# Altium project soft_starter.PrjPcb
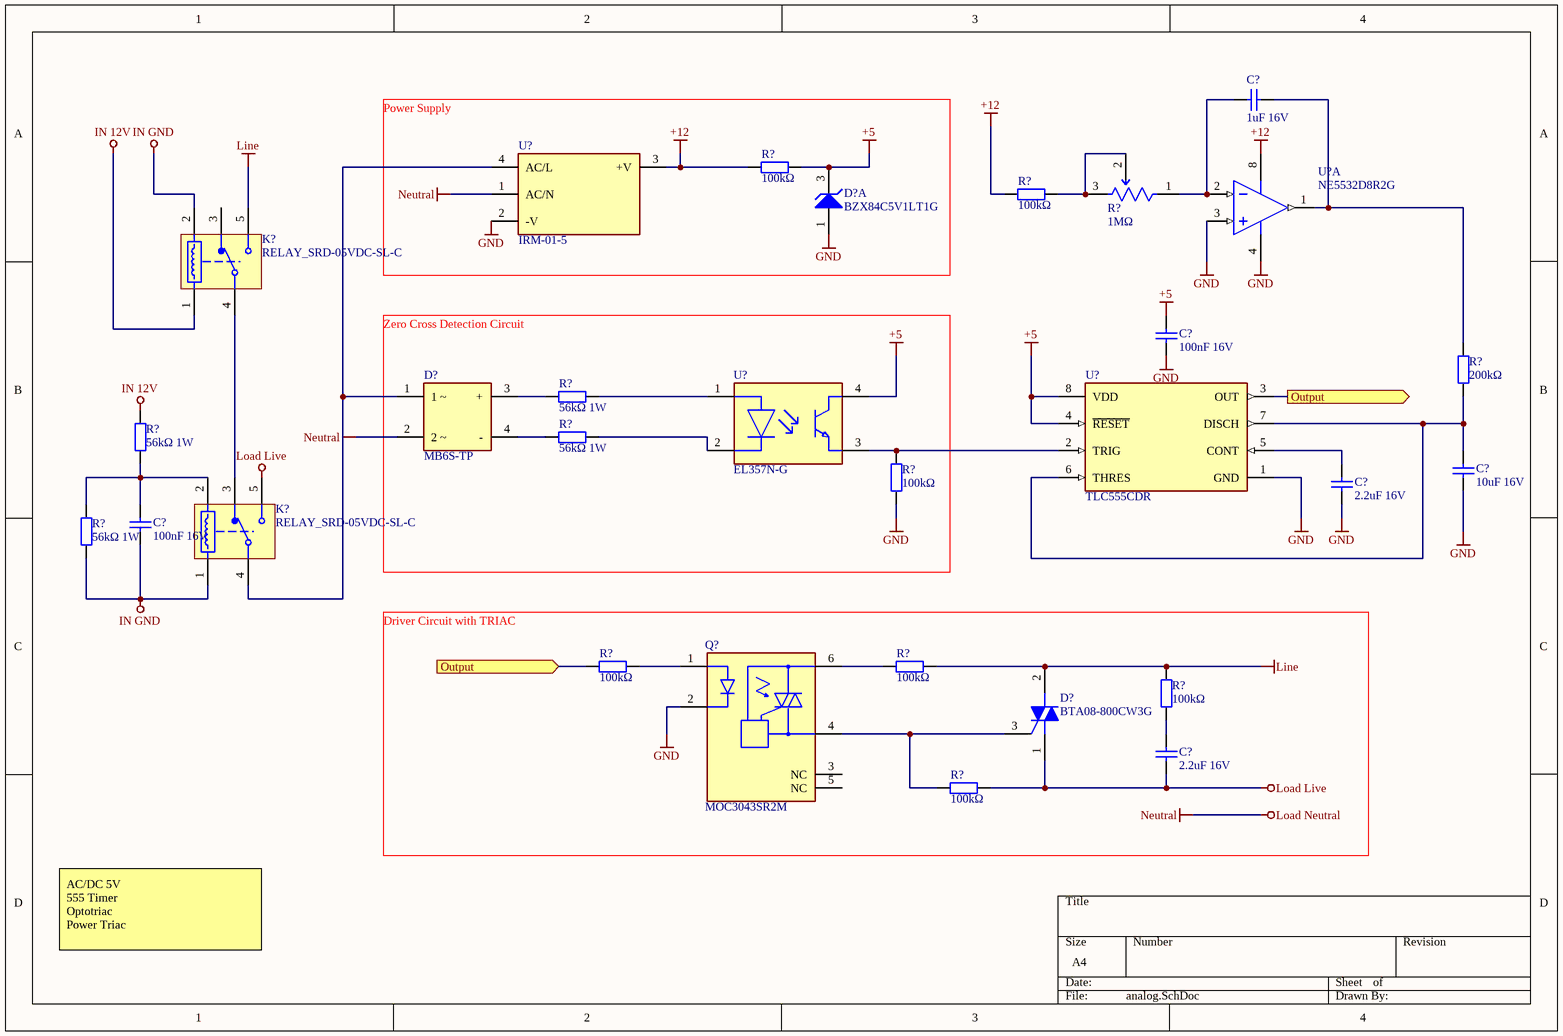
[diagram p0: analog.SchDoc]
3 sheets, 59 parts. Net scope: flat (ports and power ports of the same name join across sheets).
Sheets:
  analog.SchDoc
  mcu.SchDoc
  PCB_Project_MCU.SchDoc

## Sheet analog.SchDoc
size A4

### Parts
(Parts that share a designator on the sheet are numbered #1, #2 ... from top to bottom, then left to right.)
C?#1  1uF 16V  [CAP_0805]
C?#2  100nF 16V  [CAP_0805]
C?#3  10uF 16V  [CAP_0805]
C?#4  2.2uF 16V  [CAP_0805]
C?#5  100nF 16V  [CAP_0805]
C?#6  2.2uF 16V  [CAP_0805]
D?#1  BZX84C5V1LT1G  [ONSC-SOT-23-3-318-08_V]  (part A of 2)
D?#2  MB6S-TP  [FP-MBS-1-MFG]
D?#3  BTA08-800CW3G  [ONSC-TO-220-3-221A-07]
K?#1  RELAY_SRD-05VDC-SL-C  [SRD-05-VDC-SL-C]
K?#2  RELAY_SRD-05VDC-SL-C  [SRD-05-VDC-SL-C]
Q?#1  MOC3043SR2M  [FP-646BY-MFG]
R?#1  100kΩ  [RES_0805]
R?#2  100kΩ  [RES_0805]
R?#3  1MΩ  [FP-3386P-MFG]
R?#4  200kΩ  [RES_0805]
R?#5  56kΩ 1W  [RES_0805]
R?#6  56kΩ 1W  [RES_0805]
R?#7  56kΩ 1W  [RES_0805]
R?#8  100kΩ  [RES_0805]
R?#9  56kΩ 1W  [RES_0805]
R?#10  100kΩ  [RES_0805]
R?#11  100kΩ  [RES_0805]
R?#12  100kΩ  [RES_0805]
R?#13  100kΩ  [RES_0805]
U?#1  IRM-01-5  [FP-IRM-01-5-MFG]
U?#2  NE5532D8R2G  [ONSC-SOIC-8-751-07_V]  (part A of 2)
U?#3  TLC555CDR  [FP-D0008A-IPC_B]
U?#4  EL357N-G  [SOP-4_4mm]

### Ports
Output (in), Output (out)

### Nets
+5: C?#2.2 D?#1.3(K) R?#1.1 U?#3.4(~{RESET}) U?#3.8(VDD) U?#4.4(C)
+12: R?#1.2 R?#2.2 U?#1.3(+V) U?#2.8(V+)
GND: C?#2.1 C?#3.1 C?#4.1 D?#1.1(A) Q?#1.2(C) R?#8.1 U?#1.2(-V) U?#2.3(INA+) U?#2.4(V-) U?#3.1(GND)
IN 12V: K?#1.1 R?#7.2
IN GND: C?#5.1 K?#1.2 K?#2.1 R?#9.1
Line: D?#3.2(MT2) K?#1.5(NO) R?#11.1 R?#12.1
Load Live: C?#6.1 D?#3.1(MT1) K?#2.5(NO) R?#13.1
Load Neutral: D?#2.2(2_~) U?#1.1(AC/N)  [also labelled Neutral]
NetC?#1_1: C?#1.1 R?#3.1(CCW) U?#2.2(INA-)
NetC?#1_2: C?#1.2 R?#4.2 U?#2.1(OUTA)
NetC?#3_2: C?#3.2 R?#4.1 U?#3.6(THRES) U?#3.7(DISCH)
NetC?#4_2: C?#4.2 U?#3.5(CONT)
NetC?#5_2: C?#5.2 K?#2.2 R?#7.1 R?#9.2
NetC?#6_2: C?#6.2 R?#12.2
NetD?#2_1: D?#2.1(1_~) K?#2.4(COM) U?#1.4(AC/L)
NetD?#2_3: D?#2.3(+) R?#5.1
NetD?#2_4: D?#2.4(-) R?#6.1
NetD?#3_3: D?#3.3(G) Q?#1.4(1_MAIN_TERM.) R?#13.2
NetK?#1_4: K?#1.4(COM) K?#2.3(NC)
NetQ?#1_1: Q?#1.1(A) R?#10.1
NetQ?#1_6: Q?#1.6(2_MAIN_TERM.) R?#11.2
NetR?#2_1: R?#2.1 R?#3.2(WIPER) R?#3.3(CW)
NetR?#5_2: R?#5.2 U?#4.1(A)
NetR?#6_2: R?#6.2 U?#4.2(C)
NetR?#8_2: R?#8.2 U?#3.2(TRIG) U?#4.3(E)
NetR?#10_2: R?#10.2 U?#3.3(OUT) ; port Output

Not connected (* = marked no-connect by the designer): K?#1 3(NC); Q?#1 3(NC) 5(NC)

### Notes on the sheet
- Power Supply
- Zero Cross Detection Circuit
- Driver Circuit with TRIAC
- AC/DC 5V
  555 Timer
  Optotriac
  Power Triac

### Library data of the parts
C?#1-C?#6 = CAP_2.2uF_0805: Cap Ceramic 2.2uF 16V X7R 10% Pad SMD 0805 Soft Termination 125C Automotive T/R; Manufacturer: Murata; Manufacturer Part Number: GCJ21BR71C225KA13L; Supplier 1: Mouser; RoHS: Yes; Category: Ceramic Capacitors; Stock 1: 34901; Pricing 1: 1=0.49000, 10=0.34200, 50=0.34200, 100=0.20500, 500=0.15400, 1000=0.13000, 3000=0.12200, 6000=0.11600, 10000=0.11600 (USD); Mount: Surface Mount; Case/Package: 0805; Case Code (Metric): 2012; Case Code (Imperial): 0805; Min Operating Temperature: -55°C; Max Operating Temperature: 125°C; Capacitance: 2.2uF; Tolerance: 10%; Packaging: Tape and Reel; Voltage Rating: 16V; Dielectric: X7R; Voltage Rating (DC): 16V; Package Quantity: 1; Termination: SMD/SMT; Series: GCJ; Construction: Flat; Features: Soft Termination; Length: 2mm; Width: 0.049inch; Height: 1.25mm; Thickness: 0.057inch; Depth: 1.25mm; Ratings: AEC-Q200; Radiation Hardening: No; RoHS Compliant: Yes; Lead Free: Lead Free; ComponentLink1URL: https://datasheet.ciiva.com/172/product-172726.pdf?src-supplier=Digi-Key; ComponentLink1Description: https://datasheet.ciiva.com/172/product-172726.pdf?src-supplier=Digi-Key; ComponentLink2URL: https://datasheet.ciiva.com/172/s0717e-172727.pdf?src-supplier=Digi-Key; ComponentLink2Description: https://datasheet.ciiva.com/172/s0717e-172727.pdf?src-supplier=Digi-Key; ComponentLink3URL: https://datasheet.ciiva.com/172/s0717e-172728.pdf?src-supplier=Digi-Key; ComponentLink3Description: https://datasheet.ciiva.com/172/s0717e-172728.pdf?src-supplier=Digi-Key; Supplier Part Number 1: 81-GCJ21BR71C225KA3L
D?#1 = CMP-1060-00946-1: Zener Voltage Regulator, 225 mW, 3-Pin SOT-23, Pb-Free, Tape and Reel; Manufacturer: On Semiconductor; Mounting Technology: Surface Mount; ComponentLink1URL: http://www.onsemi.com/; PartNumber: BZX84C5V1LT1G; DatasheetVersion: Rev. 17; PackageDescription: 3-Pin Small Outline Transistor, Body 2.92 x 1.3 mm, Pitch 0.95 mm; ComponentLink2Description: Datasheet; PackageVersion: Rev. AP, 11/2009; PackageReference: SOT-23-3-318-08; ComponentLink3Description: Package Specification; RoHS: Pb-Free; ComponentLink3URL: http://www.onsemi.cn/pub_link/Collateral/318-08.PDF; ComponentLink2URL: http://www.onsemi.com/pub_link/Collateral/BZX84C2V4LT1-D.PDF; Packing: Tape and Reel; ComponentLink1Description: Manufacturer URL
D?#2 = CMP-56207-000002-1: BRIDGE RECT 1P 600V 500MA MBS-1; Manufacturer: MCC; Value: 13pF; Max Surge Forward Current: 35A; Standoff Height: 0.05mm; Max Junction Temp: +150°C; Forward Current: 0.5A; Peak Reverse Current: 5uA; Temperature: -55°C to +150°C; Temperature Range High: +150°C; Package: MBS-1; Temperature Range Low: -55°C; Octopart: https://octopart.com/mb6s-tp-mcc-733391; Max Repetitive Reverse Voltage: 600V; Mouser Description: Bridge Rectifiers .5A 600V; ComponentLink2URL: https://www.mccsemi.com/pdf/Products/MB05S-MB10S(MBS-1)-H.pdf; Reverse Voltage: 600V; ComponentLink2Description: Datasheet; Height: 2.9mm; Manufacturer Part Number: MB6S-TP; Lead Free: Yes; RoHS: TRUE; Category: Diode; Device Class L2: Diodes; Digikey Description: BRIDGE RECT 1P 600V 500MA MBS-1; Device Class L1: Discrete Semiconductors; Automotive: No; Device Class L3: Rectifier Diodes; Capacitance: 13pF
D?#3 = CMP-1070-00054-1: Triacs, Silicon Bidirectional Thyristor, 3-Pin TO-220, Pb-Free, Tube; Manufacturer: On Semiconductor; ITSM Max (A): 90; IT(RMS) Max (A): 8; IGT Max (mA): 35; ComponentLink2Description: Datasheet; PackageVersion: Rev. O, 07/2008; DatasheetVersion: Rev. 0; ComponentLink1Description: Manufacturer URL; Packing: Tube; PackageDescription: 3-Pin Flange Mount, Vertical Straight Lead, Body 9.97 x 4.445 mm, Pitch 2.54 mm; Mounting Technology: Through Hole; PackageReference: TO-220-3-221A-07; ComponentLink3Description: Package Specification; RoHS: Pb-Free; PartNumber: BTA08-800CW3G; ComponentLink1URL: http://www.onsemi.com/; ComponentLink3URL: http://www.onsemi.com/pub_link/Collateral/221A-07.PDF; ComponentLink2URL: http://www.onsemi.com/pub_link/Collateral/BTA08-800CW3-D.PDF
K?#1 K?#2 = RELAY_SRD-05VDC-SL-C: 5VDC SPDT Relay; Switching power: 240W; Max. AC current: 3A; Max. DC current: 7A; ca: 7A
Q?#1 = CMP-07144-000011-2: OPTOISOLATOR 4.17KV TRIAC 6SMD; Forward Voltage: 1.5V; Approvals: UL; Number of Circuits: 1; Output Voltage: 400V; Nominal Input Voltage: 1.25V; Hold Current: 400uA; Forward Current: 60mA; Max Power Dissipation: 250mW; Reverse Breakdown Voltage: 6V; Isolation Voltage: 5.25kV; Radiation Hardening: No; Number of Pins: 6; Max Input Voltage: 1.5V; Case/Package: SMD/SMT; Mount: Surface Mount; REACH SVHC: No SVHC; Number of Channels: 1; Weight: 0.81g; Contact Plating: Tin; Min Operating Temperature: -40°C; Packaging: Tape and Reel; Max Input Current: 60mA; Lead Free: Lead Free; Power Dissipation: 250mW; Input Current: 60mA; Max Operating Temperature: 85°C; Package Quantity: 1; Number of Elements: 1
R?#1 R?#2 R?#4-R?#13 = RES_100kohm_0805: Res Thick Film 0805 100K Ohm 1% 0.125W(1/8W) ±100ppm/°C Molded SMD Punched Carrier T/R; Manufacturer: Panasonic; Manufacturer Part Number: ERJ-6ENF1003V; Resistance: 100kR; Max Power Dissipation: 125mW; Voltage Rating (DC): 150V; Supplier 1: Mouser; RoHS: Yes; Category: Chip SMD Resistors; Stock 1: 3449; Pricing 1: 1=0.11000, 10=0.08300, 50=0.08300, 100=0.03200, 1000=0.01400, 2500=0.01300, 5000=0.01000, 10000=0.01000 (USD); Mount: Surface Mount; Case/Package: 0805; Number of Pins: 2; Case Code (Metric): 2012; Case Code (Imperial): 0805; Contact Plating: Tin; Min Operating Temperature: -55°C; Max Operating Temperature: 155°C; Tolerance: 1%; Packaging: Tape and Reel; Number of Terminations: 2; Temperature Coefficient: 100ppm/°C; Resistor Type: Thick Film; Features: Automotive AEC-Q200; Power Rating: 125mW; Package Quantity: 1; Voltage Rating: 150V; Termination: SMD/SMT; Length: 2mm; Width: 0.049inch; Height: 0.6mm; Depth: 1.25mm; Radiation Hardening: No; Lead Free: Lead Free; Military Standard: Not; REACH SVHC: No SVHC; ComponentLink1URL: https://datasheet.ciiva.com/11821/0900766b80f80784-11821507.pdf?src-supplier=RSComponents; ComponentLink1Description: https://datasheet.ciiva.com/11821/0900766b80f80784-11821507.pdf?src-supplier=RSComponents; ComponentLink2URL: https://datasheet.ciiva.com/22723/426256-22723909.pdf?src-supplier=Element14; ComponentLink2Description: https://datasheet.ciiva.com/22723/426256-22723909.pdf?src-supplier=Element14; ComponentLink3URL: https://datasheet.ciiva.com/46419/1678782-46419877.pdf?src-supplier=Element14; ComponentLink3Description: https://datasheet.ciiva.com/46419/1678782-46419877.pdf?src-supplier=Element14; ComponentLink4URL: https://datasheet.ciiva.com/27055/1988989-27055734.pdf?src-supplier=Jameco; ComponentLink4Description: https://datasheet.ciiva.com/27055/1988989-27055734.pdf?src-supplier=Jameco; ComponentLink5URL: https://datasheet.ciiva.com/16449/aoa0000ce2-16449480.pdf?src-supplier=Future+Electronics; ComponentLink5Description: https://datasheet.ciiva.com/16449/aoa0000ce2-16449480.pdf?src-supplier=Future+Electronics; ComponentLink6URL: https://datasheet.ciiva.com/17208/aoa0000ce2-17208153.pdf?src-supplier=Avnet+Europe; ComponentLink6Description: https://datasheet.ciiva.com/17208/aoa0000ce2-17208153.pdf?src-supplier=Avnet+Europe; ComponentLink7URL: https://datasheet.ciiva.com/22667/1678782-22667897.pdf?src-supplier=Element14; ComponentLink7Description: https://datasheet.ciiva.com/22667/1678782-22667897.pdf?src-supplier=Element14; ComponentLink8URL: https://datasheet.ciiva.com/24023/aoa0000ce2-24023497.pdf?src-supplier=Mouser; ComponentLink8Description: https://datasheet.ciiva.com/24023/aoa0000ce2-24023497.pdf?src-supplier=Mouser; ComponentLink9URL: https://datasheet.ciiva.com/7830/426256-7830746.pdf?src-supplier=Element14; ComponentLink9Description: https://datasheet.ciiva.com/7830/426256-7830746.pdf?src-supplier=Element14; ComponentLink10URL: https://datasheet.ciiva.com/30257/aoa0000ce2-30257690.pdf?src-supplier=Onlinecomponents.com; ComponentLink10Description: https://datasheet.ciiva.com/30257/aoa0000ce2-30257690.pdf?src-supplier=Onlinecomponents.com; ComponentLink11URL: https://datasheet.ciiva.com/7830/426256-7830988.pdf?src-supplier=Element14; ComponentLink11Description: https://datasheet.ciiva.com/7830/426256-7830988.pdf?src-supplier=Element14; ComponentLink12URL: https://datasheet.ciiva.com/16776/70260748-16776892.pdf?src-supplier=Allied+Electronics; ComponentLink12Description: https://datasheet.ciiva.com/16776/70260748-16776892.pdf?src-supplier=Allied+Electronics; ComponentLink13URL: https://datasheet.ciiva.com/16788/70260748-16788734.pdf?src-supplier=Allied+Electronics; ComponentLink13Description: https://datasheet.ciiva.com/16788/70260748-16788734.pdf?src-supplier=Allied+Electronics; ComponentLink14URL: https://datasheet.ciiva.com/48531/aoa0000ce2-48531486.pdf?src-supplier=Avnet; ComponentLink14Description: https://datasheet.ciiva.com/48531/aoa0000ce2-48531486.pdf?src-supplier=Avnet; Supplier Part Number 1: 667-ERJ-6ENF1003V
R?#3 = CMP-07234-000020-1: TRIMMER 1M OHM 0.5W PC PIN TOP; Manufacturer Part Number: 3386P-1-105TLF; Manufacturer: Bourns Inc.; Tolerance: 10%; Temperature Coefficient: 100ppm/°C; Standoff Height: 0.38mm; ComponentLink2URL: https://www.bourns.com/docs/Product-Datasheets/3386.pdf; Resistance: 1MΩ; Temperature Range High: +125°C; Category: Res; Temperature: -55°C to +125°C; Series: 3386; Temperature Range Low: -55°C; Device Class L3: Variable Resistors and Potentiometers; Value: 1MΩ; Power Rating: 0.5W; Digikey Description: TRIMMER 1M OHM 0.5W PC PIN TOP; Device Class L1: Passive Components; Package: 3386P; Automotive: No; Octopart: https://octopart.com/3386p-1-105tlf-bourns-2025467; Mouser Description: Trimmer Resistors - Through Hole 3/8 1Mohms 10% 0.5Watts Square; Device Class L2: Resistors; Composition: Cermet; ComponentLink2Description: Datasheet; Height: 5.08mm; RoHS: TRUE; Lead Free: Yes
U?#1 = CMP-28435-000004-1: AC/DC CONVERTER 5V 1W; RoHS Compliant: Yes; Lead Free: Lead Free
U?#2 = CMP-1310-00266-1: Internally Compensated Dual Low Noise Operational Amplifier, 6 to 40 V, 0 to 70 degC, 8-Pin SOIC, Pb-Free, Tape and Reel; Manufacturer: On Semiconductor; VCC Min (V): 6; SR Typ (V/uS): 9; GBW Typ (MHz): 10; VCC Max (V): 40; ComponentLink3URL: http://www.onsemi.com/pub_link/Collateral/751-07.PDF; Packing: Tape and Reel; ComponentLink2URL: http://www.onsemi.cn/pub_link/Collateral/NE5532-D.PDF; RoHS: TRUE; PackageReference: SOIC-8-751-07; ComponentLink1Description: Manufacturer URL; Mounting Technology: Surface Mount; PackageVersion: Rev. AK, 02/2011; PackageDescription: 8-Pin Small Outline Integrated Circuit, Body 4.9 x 3.9 mm, Pitch 1.27 mm; PartNumber: NE5532D8R2G; ComponentLink2Description: Datasheet; DatasheetVersion: Rev. 2; ComponentLink3Description: Package Specification; ComponentLink1URL: http://www.onsemi.com/
U?#3 = CMP-04857-000001-1: IC OSC SGL TIMER 2.1MHZ 8-SOIC; Min Supply Voltage: 2V; Number of Channels: 1; Max Power Dissipation: 725mW; Max Supply Voltage: 15V; Low Level Output Current: 100mA; Current Rating: 250A; Quiescent Current: 250uA; Operating Supply Current: 360uA; High Level Output Current: -10mA; Width: 3.91mm; Case/Package: SOIC; Weight: 0.002561oz; Frequency: 2.1MHz; Height: 1.58mm; Package Quantity: 2500; REACH SVHC: No SVHC; Number of Timers/Counters: 1; Lead Free: Lead Free; Number of Pins: 8; Max Operating Temperature: 125°C; Min Operating Temperature: -40°C; Length: 4.9mm; Radiation Hardening: No; Packaging: Tape and Reel; Termination: SMD/SMT; Mount: Surface Mount; Power Dissipation: 725mW
U?#4 = OPTOCOUPLER_EL357N-G: 4 PIN SOP PHOTOTRANSISTOR PHOTOCOUPLER / CTR: 50~600% at IF =5mA, VCE =5V / 4 Pin SOP with a 2.0 mm profile; ComponentLink1Description: Datasheet; ComponentLink1URL: https://www.mouser.com/datasheet/2/143/201407061738295695-365680.pdf

## Sheet mcu.SchDoc
size A4
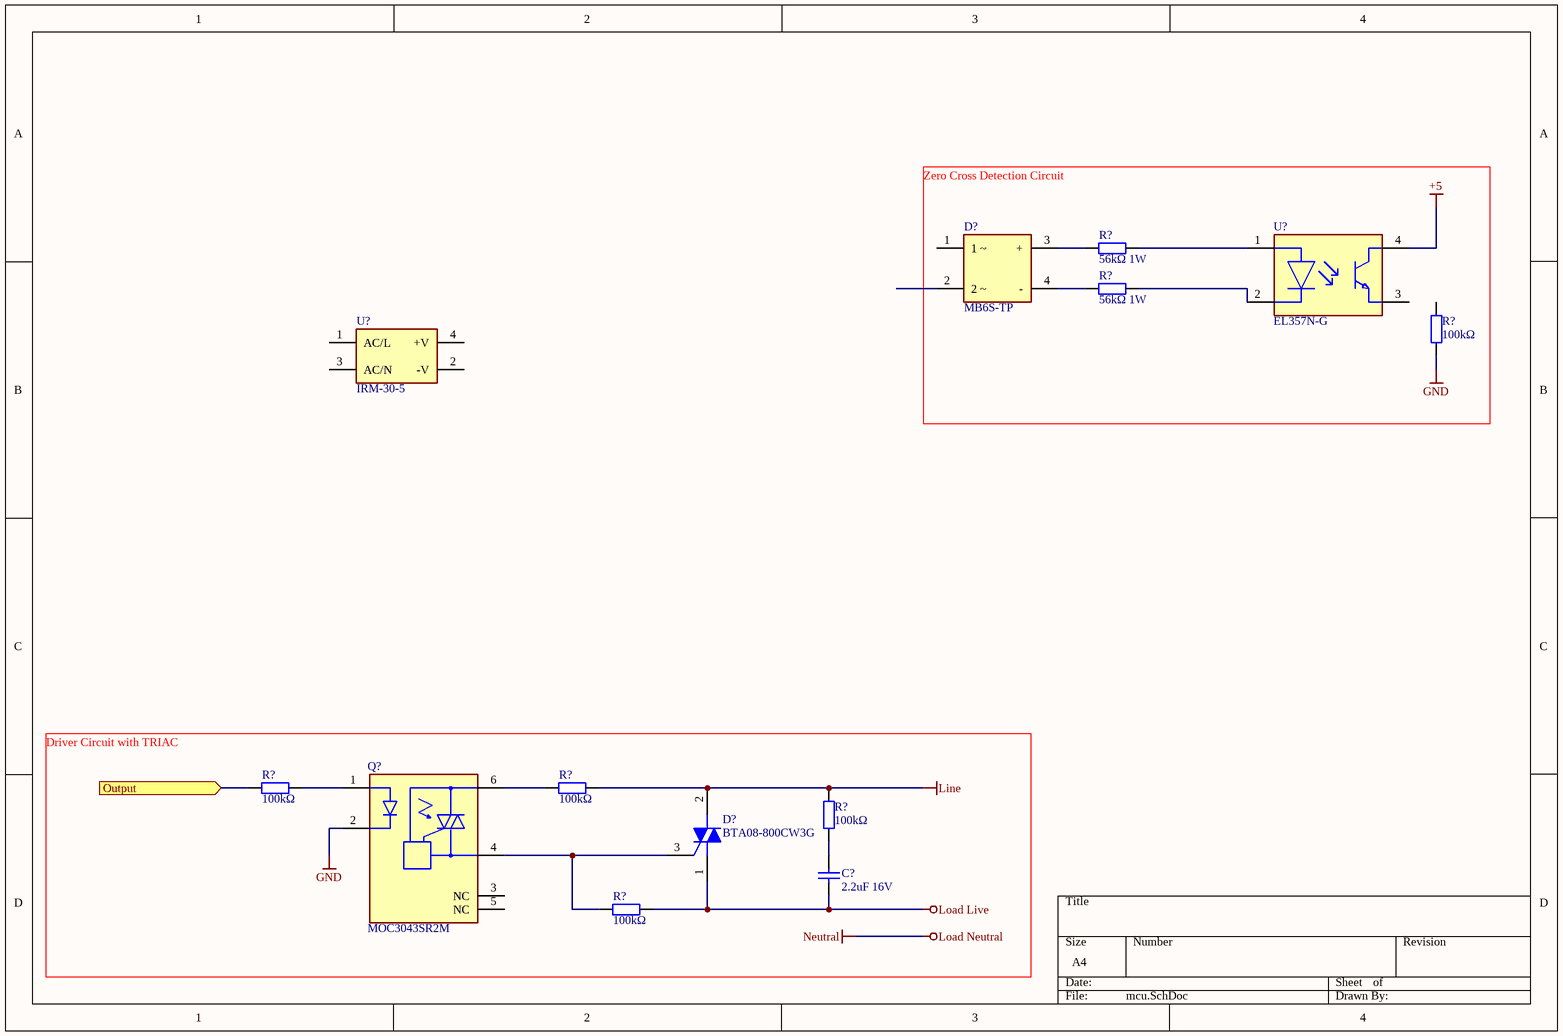
[diagram p1: mcu.SchDoc]

### Parts
(Parts that share a designator on the sheet are numbered #1, #2 ... from top to bottom, then left to right.)
C?#7  2.2uF 16V  [CAP_0805]
D?#4  MB6S-TP  [FP-MBS-1-MFG]
D?#5  BTA08-800CW3G  [ONSC-TO-220-3-221A-07]
Q?#2  MOC3043SR2M  [FP-646BY-MFG]
R?#14  56kΩ 1W  [RES_0805]
R?#15  56kΩ 1W  [RES_0805]
R?#16  100kΩ  [RES_0805]
R?#17  100kΩ  [RES_0805]
R?#18  100kΩ  [RES_0805]
R?#19  100kΩ  [RES_0805]
R?#20  100kΩ  [RES_0805]
U?#5  EL357N-G  [SOP-4_4mm]
U?#6  IRM-30-5  [FP-IRM-30-5-MFG]

### Ports
Output (in)

### Nets
+5: U?#5.4(C)
GND: Q?#2.2(C) R?#16.1
Line: D?#5.2(MT2) R?#18.1 R?#19.1
Load Live: C?#7.1 D?#5.1(MT1) R?#20.1
NetC?#7_2: C?#7.2 R?#19.2
NetD?#4_3: D?#4.3(+) R?#14.1
NetD?#4_4: D?#4.4(-) R?#15.1
NetD?#5_3: D?#5.3(G) Q?#2.4(1_MAIN_TERM.) R?#20.2
NetQ?#2_1: Q?#2.1(A) R?#17.1
NetQ?#2_6: Q?#2.6(2_MAIN_TERM.) R?#18.2
NetR?#10_2: R?#17.2 ; port Output
NetR?#14_2: R?#14.2 U?#5.1(A)
NetR?#15_2: R?#15.2 U?#5.2(C)

Not connected (* = marked no-connect by the designer): D?#4 1(1_~) 2(2_~); Q?#2 3(NC) 5(NC); R?#16 2; U?#5 3(E); U?#6 1(AC/L) 2(-V) 3(AC/N) 4(+V)

### Notes on the sheet
- Zero Cross Detection Circuit
- Driver Circuit with TRIAC

### Library data of the parts
C?#7 = CAP_2.2uF_0805: as C?#1 on sheet analog; Supplier 1: Mouser; RoHS: Yes; Category: Ceramic Capacitors; Stock 1: 34901; Pricing 1: 1=0.49000, 10=0.34200, 50=0.34200, 100=0.20500, 500=0.15400, 1000=0.13000, 3000=0.12200, 6000=0.11600, 10000=0.11600 (USD); Mount: Surface Mount; Case/Package: 0805; Case Code (Metric): 2012; Case Code (Imperial): 0805; Min Operating Temperature: -55°C; Max Operating Temperature: 125°C; Capacitance: 2.2uF; Tolerance: 10%; Packaging: Tape and Reel; Voltage Rating: 16V; Dielectric: X7R; Voltage Rating (DC): 16V; Package Quantity: 1; Termination: SMD/SMT; Series: GCJ; Construction: Flat; Features: Soft Termination; Length: 2mm; Width: 0.049inch; Height: 1.25mm; Thickness: 0.057inch; Depth: 1.25mm; Ratings: AEC-Q200; Radiation Hardening: No; RoHS Compliant: Yes; Lead Free: Lead Free; ComponentLink1URL: https://datasheet.ciiva.com/172/product-172726.pdf?src-supplier=Digi-Key; ComponentLink1Description: https://datasheet.ciiva.com/172/product-172726.pdf?src-supplier=Digi-Key; ComponentLink2URL: https://datasheet.ciiva.com/172/s0717e-172727.pdf?src-supplier=Digi-Key; ComponentLink2Description: https://datasheet.ciiva.com/172/s0717e-172727.pdf?src-supplier=Digi-Key; ComponentLink3URL: https://datasheet.ciiva.com/172/s0717e-172728.pdf?src-supplier=Digi-Key; ComponentLink3Description: https://datasheet.ciiva.com/172/s0717e-172728.pdf?src-supplier=Digi-Key; Supplier Part Number 1: 81-GCJ21BR71C225KA3L
D?#4 = CMP-56207-000002-1: as D?#2 on sheet analog; Temperature: -55°C to +150°C; Temperature Range High: +150°C; Package: MBS-1; Temperature Range Low: -55°C; Octopart: https://octopart.com/mb6s-tp-mcc-733391; Max Repetitive Reverse Voltage: 600V; Mouser Description: Bridge Rectifiers .5A 600V; ComponentLink2URL: https://www.mccsemi.com/pdf/Products/MB05S-MB10S(MBS-1)-H.pdf; Reverse Voltage: 600V; ComponentLink2Description: Datasheet; Height: 2.9mm; Manufacturer Part Number: MB6S-TP; Lead Free: Yes; RoHS: TRUE; Category: Diode; Device Class L2: Diodes; Digikey Description: BRIDGE RECT 1P 600V 500MA MBS-1; Device Class L1: Discrete Semiconductors; Automotive: No; Device Class L3: Rectifier Diodes; Capacitance: 13pF
D?#5 = CMP-1070-00054-1: as D?#3 on sheet analog; ComponentLink2Description: Datasheet; PackageVersion: Rev. O, 07/2008; DatasheetVersion: Rev. 0; ComponentLink1Description: Manufacturer URL; Packing: Tube; PackageDescription: 3-Pin Flange Mount, Vertical Straight Lead, Body 9.97 x 4.445 mm, Pitch 2.54 mm; Mounting Technology: Through Hole; PackageReference: TO-220-3-221A-07; ComponentLink3Description: Package Specification; RoHS: Pb-Free; PartNumber: BTA08-800CW3G; ComponentLink1URL: http://www.onsemi.com/; ComponentLink3URL: http://www.onsemi.com/pub_link/Collateral/221A-07.PDF; ComponentLink2URL: http://www.onsemi.com/pub_link/Collateral/BTA08-800CW3-D.PDF
Q?#2 = CMP-07144-000011-2: as Q?#1 on sheet analog; Radiation Hardening: No; Number of Pins: 6; Max Input Voltage: 1.5V; Case/Package: SMD/SMT; Mount: Surface Mount; REACH SVHC: No SVHC; Number of Channels: 1; Weight: 0.81g; Contact Plating: Tin; Min Operating Temperature: -40°C; Packaging: Tape and Reel; Max Input Current: 60mA; Lead Free: Lead Free; Power Dissipation: 250mW; Input Current: 60mA; Max Operating Temperature: 85°C; Package Quantity: 1; Number of Elements: 1
R?#14-R?#20 = RES_100kohm_0805: as R?#1 on sheet analog; Supplier 1: Mouser; RoHS: Yes; Category: Chip SMD Resistors; Stock 1: 3449; Pricing 1: 1=0.11000, 10=0.08300, 50=0.08300, 100=0.03200, 1000=0.01400, 2500=0.01300, 5000=0.01000, 10000=0.01000 (USD); Mount: Surface Mount; Case/Package: 0805; Number of Pins: 2; Case Code (Metric): 2012; Case Code (Imperial): 0805; Contact Plating: Tin; Min Operating Temperature: -55°C; Max Operating Temperature: 155°C; Tolerance: 1%; Packaging: Tape and Reel; Number of Terminations: 2; Temperature Coefficient: 100ppm/°C; Resistor Type: Thick Film; Features: Automotive AEC-Q200; Power Rating: 125mW; Package Quantity: 1; Voltage Rating: 150V; Termination: SMD/SMT; Length: 2mm; Width: 0.049inch; Height: 0.6mm; Depth: 1.25mm; Radiation Hardening: No; Lead Free: Lead Free; Military Standard: Not; REACH SVHC: No SVHC; ComponentLink1URL: https://datasheet.ciiva.com/11821/0900766b80f80784-11821507.pdf?src-supplier=RSComponents; ComponentLink1Description: https://datasheet.ciiva.com/11821/0900766b80f80784-11821507.pdf?src-supplier=RSComponents; ComponentLink2URL: https://datasheet.ciiva.com/22723/426256-22723909.pdf?src-supplier=Element14; ComponentLink2Description: https://datasheet.ciiva.com/22723/426256-22723909.pdf?src-supplier=Element14; ComponentLink3URL: https://datasheet.ciiva.com/46419/1678782-46419877.pdf?src-supplier=Element14; ComponentLink3Description: https://datasheet.ciiva.com/46419/1678782-46419877.pdf?src-supplier=Element14; ComponentLink4URL: https://datasheet.ciiva.com/27055/1988989-27055734.pdf?src-supplier=Jameco; ComponentLink4Description: https://datasheet.ciiva.com/27055/1988989-27055734.pdf?src-supplier=Jameco; ComponentLink5URL: https://datasheet.ciiva.com/16449/aoa0000ce2-16449480.pdf?src-supplier=Future+Electronics; ComponentLink5Description: https://datasheet.ciiva.com/16449/aoa0000ce2-16449480.pdf?src-supplier=Future+Electronics; ComponentLink6URL: https://datasheet.ciiva.com/17208/aoa0000ce2-17208153.pdf?src-supplier=Avnet+Europe; ComponentLink6Description: https://datasheet.ciiva.com/17208/aoa0000ce2-17208153.pdf?src-supplier=Avnet+Europe; ComponentLink7URL: https://datasheet.ciiva.com/22667/1678782-22667897.pdf?src-supplier=Element14; ComponentLink7Description: https://datasheet.ciiva.com/22667/1678782-22667897.pdf?src-supplier=Element14; ComponentLink8URL: https://datasheet.ciiva.com/24023/aoa0000ce2-24023497.pdf?src-supplier=Mouser; ComponentLink8Description: https://datasheet.ciiva.com/24023/aoa0000ce2-24023497.pdf?src-supplier=Mouser; ComponentLink9URL: https://datasheet.ciiva.com/7830/426256-7830746.pdf?src-supplier=Element14; ComponentLink9Description: https://datasheet.ciiva.com/7830/426256-7830746.pdf?src-supplier=Element14; ComponentLink10URL: https://datasheet.ciiva.com/30257/aoa0000ce2-30257690.pdf?src-supplier=Onlinecomponents.com; ComponentLink10Description: https://datasheet.ciiva.com/30257/aoa0000ce2-30257690.pdf?src-supplier=Onlinecomponents.com; ComponentLink11URL: https://datasheet.ciiva.com/7830/426256-7830988.pdf?src-supplier=Element14; ComponentLink11Description: https://datasheet.ciiva.com/7830/426256-7830988.pdf?src-supplier=Element14; ComponentLink12URL: https://datasheet.ciiva.com/16776/70260748-16776892.pdf?src-supplier=Allied+Electronics; ComponentLink12Description: https://datasheet.ciiva.com/16776/70260748-16776892.pdf?src-supplier=Allied+Electronics; ComponentLink13URL: https://datasheet.ciiva.com/16788/70260748-16788734.pdf?src-supplier=Allied+Electronics; ComponentLink13Description: https://datasheet.ciiva.com/16788/70260748-16788734.pdf?src-supplier=Allied+Electronics; ComponentLink14URL: https://datasheet.ciiva.com/48531/aoa0000ce2-48531486.pdf?src-supplier=Avnet; ComponentLink14Description: https://datasheet.ciiva.com/48531/aoa0000ce2-48531486.pdf?src-supplier=Avnet; Supplier Part Number 1: 667-ERJ-6ENF1003V
U?#5 = OPTOCOUPLER_EL357N-G: as U?#4 on sheet analog; ComponentLink1Description: Datasheet; ComponentLink1URL: https://www.mouser.com/datasheet/2/143/201407061738295695-365680.pdf
U?#6 = CMP-28435-000001-1: AC/DC CONVERTER 5V 30W; Manufacturer: Mean Well; Output Type: Fixed; Switching Topology: Buck; Max Supply Voltage: 264V; Number Of Outputs: 1; Description: Miniature AC-DC Module type Power Supply 5 Volts 6 Amps 30 W; Switching Frequency: 65kHz; Nominal Supply Current: 0.5-0.75A; Min Supply Voltage: 85V; Output Current: 6A; Temperature: -30°C to +70°C; Device Class L1: Integrated Circuits (ICs); Temperature Range Low: -30°C; Temperature Range High: +70°C; ComponentLink2Description: Datasheet; Lead Free: Yes; Device Class L2: Power Management ICs; ComponentLink2URL: https://www.meanwell-web.com/content/files/pdfs/productPdfs/MW/IRM-30/IRM-30-spec.pdf; Mouser Description: 30W Encapsulated Board Mount Module AC/DC Power Supply with 5VDC Output; Automotive: No; Device Class L3: Voltage Regulators - Switching; Octopart: https://octopart.com/irm-30-5-mean+well-50976023; Category: IC; Package: IRM-30-5; Output Voltage: 5V; RoHS: TRUE; Manufacturer Part Number: IRM-30-5; Height: 24mm; Digikey Description: AC/DC CONVERTER 5V 30W

## Sheet PCB_Project_MCU.SchDoc
size A4; SheetTotal: 6; ImagePath: 6
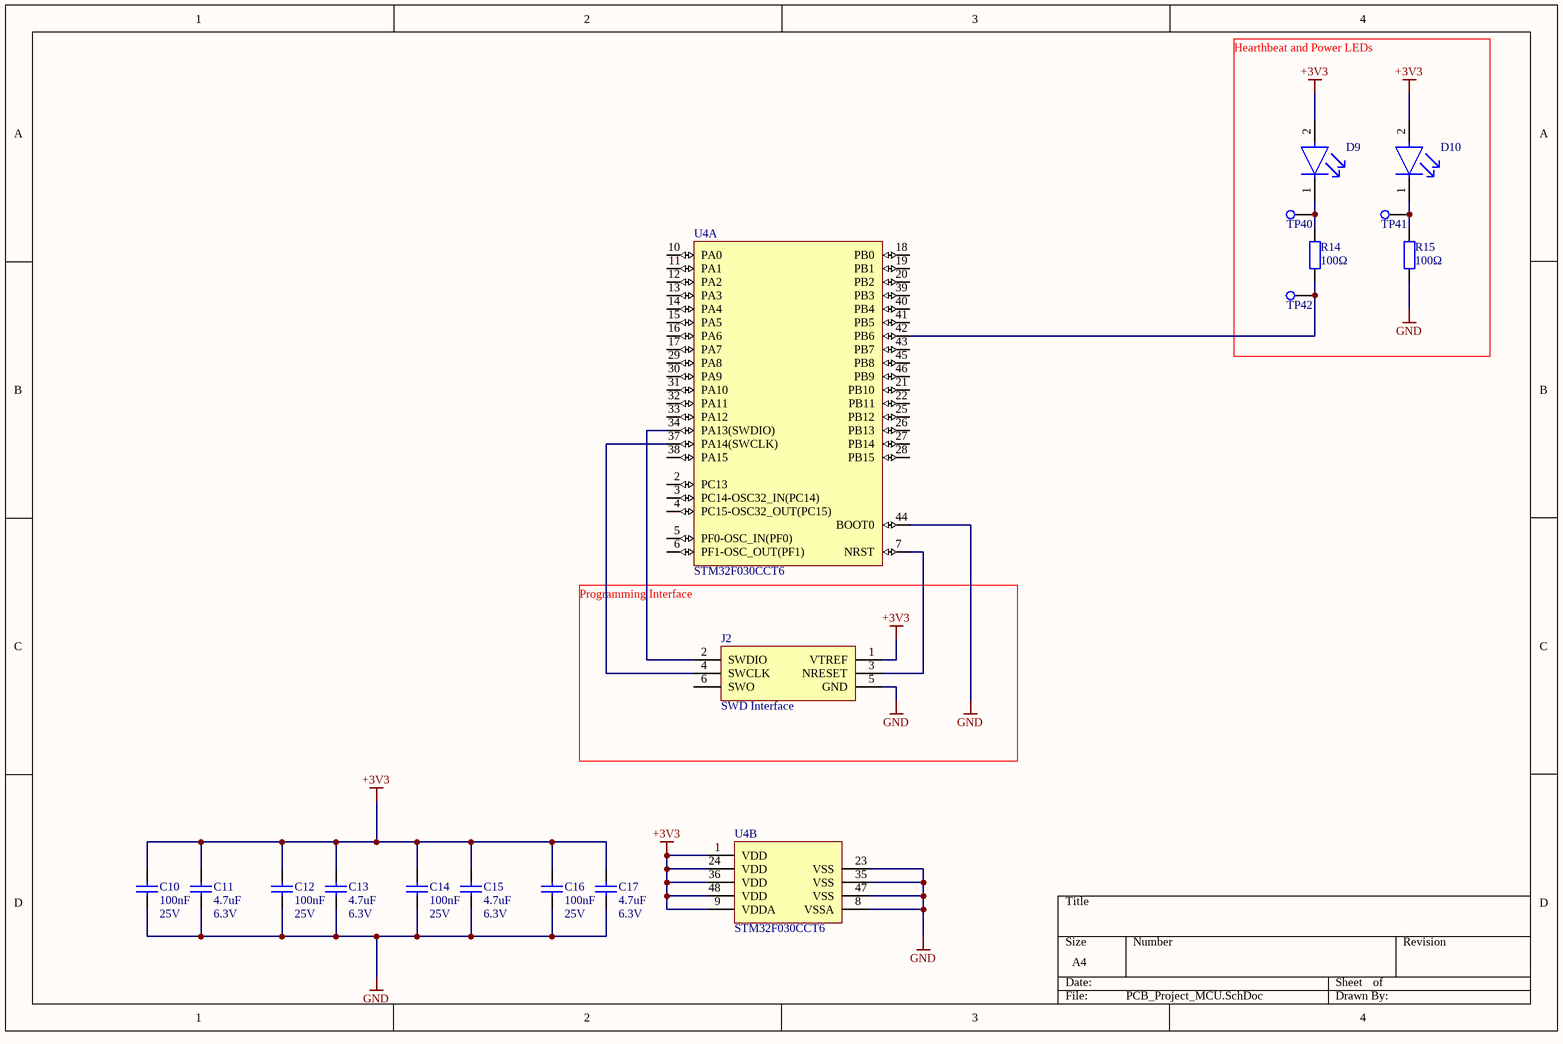
[diagram p2: PCB_Project_MCU.SchDoc]

### Parts
C10  Capacitance: 100nF  Voltage Rating: 25V  [CAPC2013X88X50ML20T25]  (hidden comment: Cap_100nF)
C11  Capacitance: 4.7uF  Voltage Rating: 6.3V  [CAPC2013X88X50ML20T25]  (hidden comment: Cap_4.7uF)
C12  Capacitance: 100nF  Voltage Rating: 25V  [CAPC2013X88X50ML20T25]  (hidden comment: Cap_100nF)
C13  Capacitance: 4.7uF  Voltage Rating: 6.3V  [CAPC2013X88X50ML20T25]  (hidden comment: Cap_4.7uF)
C14  Capacitance: 100nF  Voltage Rating: 25V  [CAPC2013X88X50ML20T25]  (hidden comment: Cap_100nF)
C15  Capacitance: 4.7uF  Voltage Rating: 6.3V  [CAPC2013X88X50ML20T25]  (hidden comment: Cap_4.7uF)
C16  Capacitance: 100nF  Voltage Rating: 25V  [CAPC2013X88X50ML20T25]  (hidden comment: Cap_100nF)
C17  Capacitance: 4.7uF  Voltage Rating: 6.3V  [CAPC2013X88X50ML20T25]  (hidden comment: Cap_4.7uF)
D9  LTST-C171GKT  [green_led]  (value not drawn)
D10  LTST-C171GKT  [green_led]  (value not drawn)
J2  SWD Interface  [J-Link_6-pin_Needle_Adapter]  (no BOM)
R14  Resistance: 100Ω  [RESC2013X50X30ML20T20]  (hidden comment: Res_120ohm)
R15  Resistance: 100Ω  [RESC2013X50X30ML20T20]  (hidden comment: Res_100ohm)
TP40  Testpoint  [TESTPOINT]  (value not drawn)  (no BOM)
TP41  Testpoint  [TESTPOINT]  (value not drawn)  (no BOM)
TP42  Testpoint  [TESTPOINT]  (value not drawn)  (no BOM)
U4  STM32F030CCT6  [STM-LQFP48_N]  (parts A,B of 2)

### Nets
+3V3: C10.2 C11.2 C12.2 C13.2 C14.2 C15.2 C16.2 C17.2 D9.2(A) D10.2(A) J2.1(VTREF) U4.1(VDD) U4.9(VDDA) U4.24(VDD) U4.36(VDD) U4.48(VDD)
GND: C10.1 C11.1 C12.1 C13.1 C14.1 C15.1 C16.1 C17.1 J2.5(GND) R15.1 U4.8(VSSA) U4.23(VSS) U4.35(VSS) U4.44(BOOT0) U4.47(VSS)
NetD9_1: D9.1(C) R14.2 TP40.TP
NetD10_1: D10.1(C) R15.2 TP41.TP
NetJ2_2: J2.2(SWDIO) U4.34(PA13(SWDIO))
NetJ2_3: J2.3(NRESET) U4.7(NRST)
NetJ2_4: J2.4(SWCLK) U4.37(PA14(SWCLK))
NetR14_1: R14.1 TP42.TP U4.42(PB6)

Not connected (* = marked no-connect by the designer): J2 6(SWO); U4 2(PC13) 3(PC14-OSC32_IN(PC14)) 4(PC15-OSC32_OUT(PC15)) 5(PF0-OSC_IN(PF0)) 6(PF1-OSC_OUT(PF1)) 10(PA0) 11(PA1) 12(PA2) 13(PA3) 14(PA4) 15(PA5) 16(PA6) 17(PA7) 18(PB0) 19(PB1) 20(PB2) 21(PB10) 22(PB11) 25(PB12) 26(PB13) 27(PB14) 28(PB15) 29(PA8) 30(PA9) 31(PA10) 32(PA11) 33(PA12) 38(PA15) 39(PB3) 40(PB4) 41(PB5) 43(PB7) 45(PB8) 46(PB9)

### Notes on the sheet
- Hearthbeat and Power LEDs
- (near J2) Programming Interface
- Gezeichnet:
- Artikelname:
- Biral AG
- CH 3110 Münsingen
- Format:
- Blatt:
- A4
- Artikelnummer:
- Zeichnungsnummer:
- Geprüft:
- Index:
- of

### Library data of the parts
C10 C12 C14 C16 = Cap_100nF: Capacitor; Manufacturer 1: KEMET; Manufacturer Part Number 1: C0805C104M3RACTU; Dielectric Material: Ceramic; Tolerance: 20%; Dielectric: X7R; Dissipation Factor: 5%; Supplier 1: Farnell; Stock 1: 12809; Pricing 1: 10=0.07910, 100=0.04240, 500=0.02510, 1000=0.02420, 2000=0.02100, 4000=0.01800, 20000=0.01260 (CHF); RoHS: Yes; Mount: Surface Mount; Case/Package: 0805; Case Code (Metric): 2012; Case Code (Imperial): 0805; Min Operating Temperature: -55°C; Max Operating Temperature: 125°C; Packaging: Tape and Reel; Package Quantity: 1; Voltage Rating (DC): 25V; Termination: SMD/SMT; Voltage: 25V; Length: 2mm; Height: 0.9mm; Width: 0.049inch; Thickness: 0.035inch; Depth: 1.25mm; Lead Pitch: 0.75mm; Radiation Hardening: No; REACH SVHC: No SVHC; ComponentLink1URL: http://uk.rs-online.com/webdocs/13da/0900766b813daa05.pdf?src-supplier=RSComponents; ComponentLink1Description: http://uk.rs-online.com/webdocs/13da/0900766b813daa05.pdf?src-supplier=RSComponents; ComponentLink2URL: http://www.mouser.com/ds/2/212/KEM_C1002_X7R_SMD-1102033.pdf?src-supplier=Mouser; ComponentLink2Description: http://www.mouser.com/ds/2/212/KEM_C1002_X7R_SMD-1102033.pdf?src-supplier=Mouser; ComponentLink3URL: http://www.farnell.com/datasheets/2746330.pdf?src-supplier=Farnell; ComponentLink3Description: http://www.farnell.com/datasheets/2746330.pdf?src-supplier=Farnell; ComponentLink4URL: https://www.alliedelec.com/m/d/6f3b5eb83d09db50ed28bdc730567b33.pdf?src-supplier=Allied+Electronics; ComponentLink4Description: https://www.alliedelec.com/m/d/6f3b5eb83d09db50ed28bdc730567b33.pdf?src-supplier=Allied+Electronics; ComponentLink5URL: http://uk.rs-online.com/webdocs/13da/0900766b813da9ff.pdf?src-supplier=RSComponents; ComponentLink5Description: http://uk.rs-online.com/webdocs/13da/0900766b813da9ff.pdf?src-supplier=RSComponents; ComponentLink6URL: https://www.alliedelec.com/m/d/e7aa2b5497e2375e4ffc0e8be19e16e2.pdf?src-supplier=Allied+Electronics; ComponentLink6Description: https://www.alliedelec.com/m/d/e7aa2b5497e2375e4ffc0e8be19e16e2.pdf?src-supplier=Allied+Electronics; ComponentLink7URL: http://components.arrow.com/part/dataview/0323_00178100?src-supplier=Arrow+Europe; ComponentLink7Description: http://components.arrow.com/part/dataview/0323_00178100?src-supplier=Arrow+Europe; ComponentLink8URL: http://www.jameco.com/Jameco/Products/ProdDS/1566487.pdf?src-supplier=Jameco; ComponentLink8Description: http://www.jameco.com/Jameco/Products/ProdDS/1566487.pdf?src-supplier=Jameco; ComponentLink9URL: https://api.kemet.com/component-edge/download/datasheet/C0805C104M3RACTU.pdf?src-supplier=Digi-Key; ComponentLink9Description: https://api.kemet.com/component-edge/download/datasheet/C0805C104M3RACTU.pdf?src-supplier=Digi-Key; ComponentLink10URL: http://www.farnell.com/datasheets/2746330.pdf?src-supplier=Newark; ComponentLink10Description: http://www.farnell.com/datasheets/2746330.pdf?src-supplier=Newark; ComponentLink11URL: http://capacitoredge.kemet.com/capedge2/DataSheet?pn=C0805C104M3RACTU&src-supplier=Avnet; ComponentLink11Description: http://capacitoredge.kemet.com/capedge2/DataSheet?pn=C0805C104M3RACTU&src-supplier=Avnet; ComponentLink12URL: http://components.arrow.com/part/dataview/2091097S3491315N7429?src-supplier=Arrow; ComponentLink12Description: http://components.arrow.com/part/dataview/2091097S3491315N7429?src-supplier=Arrow; Supplier Part Number 1: 2773209
C11 C13 C15 C17 = Cap_4.7uF: Capacitor; Manufacturer 1: KEMET; Manufacturer Part Number 1: C0805C475K9PACTU; Dielectric Material: Ceramic; Tolerance: 10%; Dielectric: X5R; Dissipation Factor: 5%; Supplier 1: Farnell; Stock 1: 17500; Pricing 1: 2500=0.02880, 12500=0.02710 (CHF); RoHS: Yes; Mount: Surface Mount; Case/Package: 0805; Number of Pins: 2; Case Code (Imperial): 0805; Case Code (Metric): 2012; Min Operating Temperature: -55°C; Max Operating Temperature: 85°C; Packaging: Tape and Reel; Voltage Rating (DC): 6.3V; Termination: SMD/SMT; Package Quantity: 1; Voltage: 6.3V; Length: 2mm; Height: 1.25mm; Width: 1.2mm; Thickness: 0.055inch; Depth: 1.25mm; Lead Pitch: 0.75mm; Radiation Hardening: No; Lead Free: Lead Free; REACH SVHC: No SVHC; ComponentLink1URL: https://datasheet.ciiva.com/7842/1847039-7842373.pdf?src-supplier=Element14; ComponentLink1Description: https://datasheet.ciiva.com/7842/1847039-7842373.pdf?src-supplier=Element14; ComponentLink2URL: https://datasheet.ciiva.com/7842/1847039-7842374.pdf?src-supplier=Element14; ComponentLink2Description: https://datasheet.ciiva.com/7842/1847039-7842374.pdf?src-supplier=Element14; ComponentLink3URL: https://datasheet.ciiva.com/28614/kem-c1006-x5r-smd-28614764.pdf?src-supplier=Element14; ComponentLink3Description: https://datasheet.ciiva.com/28614/kem-c1006-x5r-smd-28614764.pdf?src-supplier=Element14; ComponentLink4URL: https://datasheet.ciiva.com/28682/1789732-28682365.pdf?src-supplier=Element14; ComponentLink4Description: https://datasheet.ciiva.com/28682/1789732-28682365.pdf?src-supplier=Element14; Supplier Part Number 1: 2392260
D9 D10 = LTST-C171GKT: LED GREEN CLEAR CHIP SMD; Luminous Intensity: 12mcd; Lens Color: Colorless; Dominant Wavelength: 569nm; Number of LEDs: 1; Power Dissipation: 100mW; Viewing Angle: 130°; Reverse Voltage: 5V; Test Current: 10mA; Forward Voltage: 2.1V; Wavelength: 585nm; Lens Style: Diffused; Forward Current: 30mA; Height: 0.8mm; Mount: Surface Mount; Package Quantity: 1; Length: 2mm; Case Code (Metric): 2012; Number of Pins: 2; Number of Elements: 1; Packaging: Tape and Reel; Color: Green; Min Operating Temperature: -55°C; Case/Package: 0805; Power Rating: 100mW; Max Operating Temperature: 85°C; Radiation Hardening: No; Depth: 1.25mm; Lens Transparency: Clear; Width: 1.25mm; Lead Free: Lead Free; Case Code (Imperial): 0805; Illumination Color: Green
J2 = J-Link_6-pin_Needle_Adapter: J-Link 6-pin Needle Adapter
R14 = Res_120ohm: Resistor; Manufacturer 1: Panasonic; Manufacturer Part Number 1: ERJ-6ENF1200V; Tolerance: 1%; Temperature Coefficient: 100ppm/°C; Power Rating: 125mW; Voltage Rating: 150V; Supplier 1: Farnell; Stock 1: 19028; Pricing 1: 10=0.09940, 100=0.03710, 500=0.02940, 1000=0.01260, 2500=0.01050 (CHF); RoHS: Yes; Mount: Surface Mount; Case/Package: 0805; Number of Pins: 2; Case Code (Imperial): 0805; Case Code (Metric): 2012; Contact Plating: Tin; Min Operating Temperature: -55°C; Max Operating Temperature: 155°C; Packaging: Tape and Reel; Composition: Thick Film; Package Quantity: 1; Termination: SMD/SMT; Max Power Dissipation: 125mW; Voltage Rating (DC): 150V; Number of Terminations: 2; Military Standard: Not; Features: Automotive AEC-Q200; Length: 2mm; Height: 0.6mm; Width: 1.2mm; Depth: 1.25mm; Radiation Hardening: No; REACH SVHC: No SVHC; Lead Free: Lead Free; ComponentLink1URL: https://datasheet.ciiva.com/11821/0900766b80f80784-11821533.pdf?src-supplier=RSComponents; ComponentLink1Description: https://datasheet.ciiva.com/11821/0900766b80f80784-11821533.pdf?src-supplier=RSComponents; ComponentLink2URL: https://datasheet.ciiva.com/22673/1678782-22673701.pdf?src-supplier=Element14; ComponentLink2Description: https://datasheet.ciiva.com/22673/1678782-22673701.pdf?src-supplier=Element14; ComponentLink3URL: https://datasheet.ciiva.com/15158/getdatasheetpartid-248620-15158999.pdf?src-supplier=Verical; ComponentLink3Description: https://datasheet.ciiva.com/15158/getdatasheetpartid-248620-15158999.pdf?src-supplier=Verical; ComponentLink4URL: https://datasheet.ciiva.com/16782/70260748-16782215.pdf?src-supplier=Allied+Electronics; ComponentLink4Description: https://datasheet.ciiva.com/16782/70260748-16782215.pdf?src-supplier=Allied+Electronics; ComponentLink5URL: https://datasheet.ciiva.com/24069/aoa0000ce2-24069192.pdf?src-supplier=Mouser; ComponentLink5Description: https://datasheet.ciiva.com/24069/aoa0000ce2-24069192.pdf?src-supplier=Mouser; ComponentLink6URL: https://datasheet.ciiva.com/46373/1678782-46373272.pdf?src-supplier=Element14; ComponentLink6Description: https://datasheet.ciiva.com/46373/1678782-46373272.pdf?src-supplier=Element14; ComponentLink7URL: https://datasheet.ciiva.com/46373/1678782-46373273.pdf?src-supplier=Element14; ComponentLink7Description: https://datasheet.ciiva.com/46373/1678782-46373273.pdf?src-supplier=Element14; ComponentLink8URL: https://datasheet.ciiva.com/17207/aoa0000ce2-17207722.pdf?src-supplier=Avnet+Europe; ComponentLink8Description: https://datasheet.ciiva.com/17207/aoa0000ce2-17207722.pdf?src-supplier=Avnet+Europe; ComponentLink9URL: https://datasheet.ciiva.com/6082/426256-6082139.pdf?src-supplier=Farnell; ComponentLink9Description: https://datasheet.ciiva.com/6082/426256-6082139.pdf?src-supplier=Farnell; ComponentLink10URL: https://datasheet.ciiva.com/22687/1678782-22687419.pdf?src-supplier=Element14; ComponentLink10Description: https://datasheet.ciiva.com/22687/1678782-22687419.pdf?src-supplier=Element14; ComponentLink11URL: https://datasheet.ciiva.com/7886/426256-7886749.pdf?src-supplier=Element14; ComponentLink11Description: https://datasheet.ciiva.com/7886/426256-7886749.pdf?src-supplier=Element14; ComponentLink12URL: https://datasheet.ciiva.com/9117/aoa0000ce2-9117405.pdf?src-supplier=Avnet; ComponentLink12Description: https://datasheet.ciiva.com/9117/aoa0000ce2-9117405.pdf?src-supplier=Avnet; ComponentLink13URL: https://datasheet.ciiva.com/16765/70260748-16765246.pdf?src-supplier=Allied+Electronics; ComponentLink13Description: https://datasheet.ciiva.com/16765/70260748-16765246.pdf?src-supplier=Allied+Electronics; ComponentLink14URL: https://datasheet.ciiva.com/16514/aoa0000ce2-16514031.pdf?src-supplier=Avnet+Asia; ComponentLink14Description: https://datasheet.ciiva.com/16514/aoa0000ce2-16514031.pdf?src-supplier=Avnet+Asia; Supplier Part Number 1: 2303452
R15 = Res_100ohm: Resistor; Manufacturer 1: Panasonic; Manufacturer Part Number 1: ERJ-6GEYJ101V; Tolerance: 5%; Temperature Coefficient: 200ppm/°C; Power Rating: 125mW; Voltage Rating: 150V; Supplier 1: Farnell; Stock 1: 14791; Pricing 1: 10=0.08460, 100=0.03410, 500=0.02750, 1000=0.01050, 2500=0.00940 (CHF); RoHS: Yes; Mount: Surface Mount; Case/Package: 0805; Case Code (Metric): 2012; Case Code (Imperial): 0805; Contact Plating: Tin; Min Operating Temperature: -55°C; Max Operating Temperature: 155°C; Packaging: Tape and Reel; Composition: Thick Film; Package Quantity: 5000; Termination: SMD/SMT; Max Power Dissipation: 125mW; Voltage Rating (DC): 150V; Number of Terminations: 2; Military Standard: Not; Working Voltage: 150V; Length: 2mm; Height: 0.6mm; Width: 0.049inch; Depth: 1.25mm; Radiation Hardening: No; Lead Free: Lead Free; REACH SVHC: No SVHC; ComponentLink1URL: https://datasheet.ciiva.com/11821/0900766b80f806dd-11821505.pdf?src-supplier=RSComponents; ComponentLink1Description: https://datasheet.ciiva.com/11821/0900766b80f806dd-11821505.pdf?src-supplier=RSComponents; ComponentLink2URL: https://datasheet.ciiva.com/34303/2007281-34303758.pdf?src-supplier=Jameco; ComponentLink2Description: https://datasheet.ciiva.com/34303/2007281-34303758.pdf?src-supplier=Jameco; ComponentLink3URL: https://datasheet.ciiva.com/17207/aoa0000ce1-17207989.pdf?src-supplier=Avnet+Europe; ComponentLink3Description: https://datasheet.ciiva.com/17207/aoa0000ce1-17207989.pdf?src-supplier=Avnet+Europe; ComponentLink4URL: https://datasheet.ciiva.com/16760/70255313-16760982.pdf?src-supplier=Allied+Electronics; ComponentLink4Description: https://datasheet.ciiva.com/16760/70255313-16760982.pdf?src-supplier=Allied+Electronics; ComponentLink5URL: https://datasheet.ciiva.com/28514/1678796-28514232.pdf?src-supplier=Element14; ComponentLink5Description: https://datasheet.ciiva.com/28514/1678796-28514232.pdf?src-supplier=Element14; ComponentLink6URL: https://datasheet.ciiva.com/22758/1500035-22758233.pdf?src-supplier=Farnell; ComponentLink6Description: https://datasheet.ciiva.com/22758/1500035-22758233.pdf?src-supplier=Farnell; ComponentLink7URL: https://datasheet.ciiva.com/24070/aoa0000ce1-37422-24070041.pdf?src-supplier=Mouser; ComponentLink7Description: https://datasheet.ciiva.com/24070/aoa0000ce1-37422-24070041.pdf?src-supplier=Mouser; ComponentLink8URL: https://datasheet.ciiva.com/43460/1500035-43460091.pdf?src-supplier=Farnell; ComponentLink8Description: https://datasheet.ciiva.com/43460/1500035-43460091.pdf?src-supplier=Farnell; ComponentLink9URL: https://datasheet.ciiva.com/30250/4aoa0000ce1-30250447.pdf?src-supplier=Onlinecomponents.com; ComponentLink9Description: https://datasheet.ciiva.com/30250/4aoa0000ce1-30250447.pdf?src-supplier=Onlinecomponents.com; Supplier Part Number 1: 2057681
U4 = STM32F030CCT6: STMICROELECTRONICS         STM32F030CCT6             32 Bit Microcontroller, Value Line, ARM Cortex-M0, 48 MHz, 256 KB, 32 KB, 48 Pins, LQFP; Frequency: 48MHz; RAM Size: 32KB; Number of I/Os: 37; Min Supply Voltage: 2.4V; Max Supply Voltage: 3.6V; Memory Size: 256KB; Interface: I2C,SPI,USART; Data Bus Width: 32b; Number of Programmable I/O: 39; Number of Timers/Counters: 5; Supplier 1: Farnell; Manufacturer 1: STMicroelectronics; Manufacturer Part Number 1: STM32F030CCT6; Stock 1: 11542; Pricing 1: 1=3.00000, 10=2.26000, 25=2.16000, 50=2.06000, 100=1.97000, 250=1.86000, 500=1.66000, 1000=1.34000 (CHF); RoHS: Yes; Mount: Surface Mount; Case/Package: LQFP; Number of Pins: 48; Contact Plating: Tin,Matte; Min Operating Temperature: -40°C; Max Operating Temperature: 85°C; Max Frequency: 48MHz; REACH SVHC: No SVHC; Lead Free: Lead Free; ComponentLink1URL: http://www.mouser.com/ds/2/389/DM00088500-490353.pdf?src-supplier=Mouser; ComponentLink1Description: http://www.mouser.com/ds/2/389/DM00088500-490353.pdf?src-supplier=Mouser; ComponentLink2URL: http://www.farnell.com/datasheets/2554494.pdf?src-supplier=Farnell; ComponentLink2Description: http://www.farnell.com/datasheets/2554494.pdf?src-supplier=Farnell; ComponentLink3URL: http://www.st.com/st-web-ui/static/active/en/resource/technical/document/datasheet/DM00088500.pdf?src-supplier=Avnet+Asia; ComponentLink3Description: http://www.st.com/st-web-ui/static/active/en/resource/technical/document/datasheet/DM00088500.pdf?src-supplier=Avnet+Asia; ComponentLink4URL: http://www.farnell.com/datasheets/2554494.pdf?src-supplier=Newark; ComponentLink4Description: http://www.farnell.com/datasheets/2554494.pdf?src-supplier=Newark; ComponentLink5URL: http://www.st.com/content/ccc/resource/technical/document/user_manual/1d/d4/af/64/18/0d/42/2c/DM00111791.pdf/files/DM00111791.pdf/jcr:content/translations/en.DM00111791.pdf?src-supplier=Digi-Key; ComponentLink5Description: http://www.st.com/content/ccc/resource/technical/document/user_manual/1d/d4/af/64/18/0d/42/2c/DM00111791.pdf/files/DM00111791.pdf/jcr:content/translations/en.DM00111791.pdf?src-supplier=Digi-Key; ComponentLink6URL: http://www.farnell.com/datasheets/1883133.pdf?src-supplier=Element14; ComponentLink6Description: http://www.farnell.com/datasheets/1883133.pdf?src-supplier=Element14; Supplier Part Number 1: 2488281

## Nets that join several sheets
+5: analog (6 pins), mcu (U?#5.4)
GND: analog (10 pins), mcu (Q?#2.2 R?#16.1), PCB_Project_MCU (15 pins)
Line: analog (D?#3.2 K?#1.5 R?#11.1 R?#12.1), mcu (D?#5.2 R?#18.1 R?#19.1)
Load Live: analog (C?#6.1 D?#3.1 K?#2.5 R?#13.1), mcu (C?#7.1 D?#5.1 R?#20.1)
NetR?#10_2: analog (R?#10.2 U?#3.3), mcu (R?#17.2)